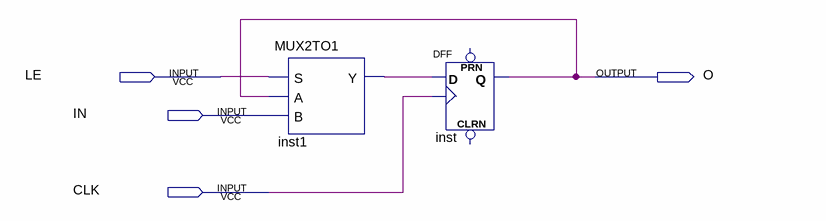
[diagram p0: schematic sheet]
// Quartus schematic REG1BIT.bdf as structural Verilog: 2 symbols, 4 pins
module REG1BIT (
  input  LE,
  input  IN,
  input  CLK,
  output O
);

  wire inst1_y;

  MUX2TO1 inst1 (.S(LE), .A(O), .B(IN), .Y(inst1_y));
  DFF inst (.CLK(CLK), .D(inst1_y), .Q(O));  // open: CLRN, PRN
endmodule
